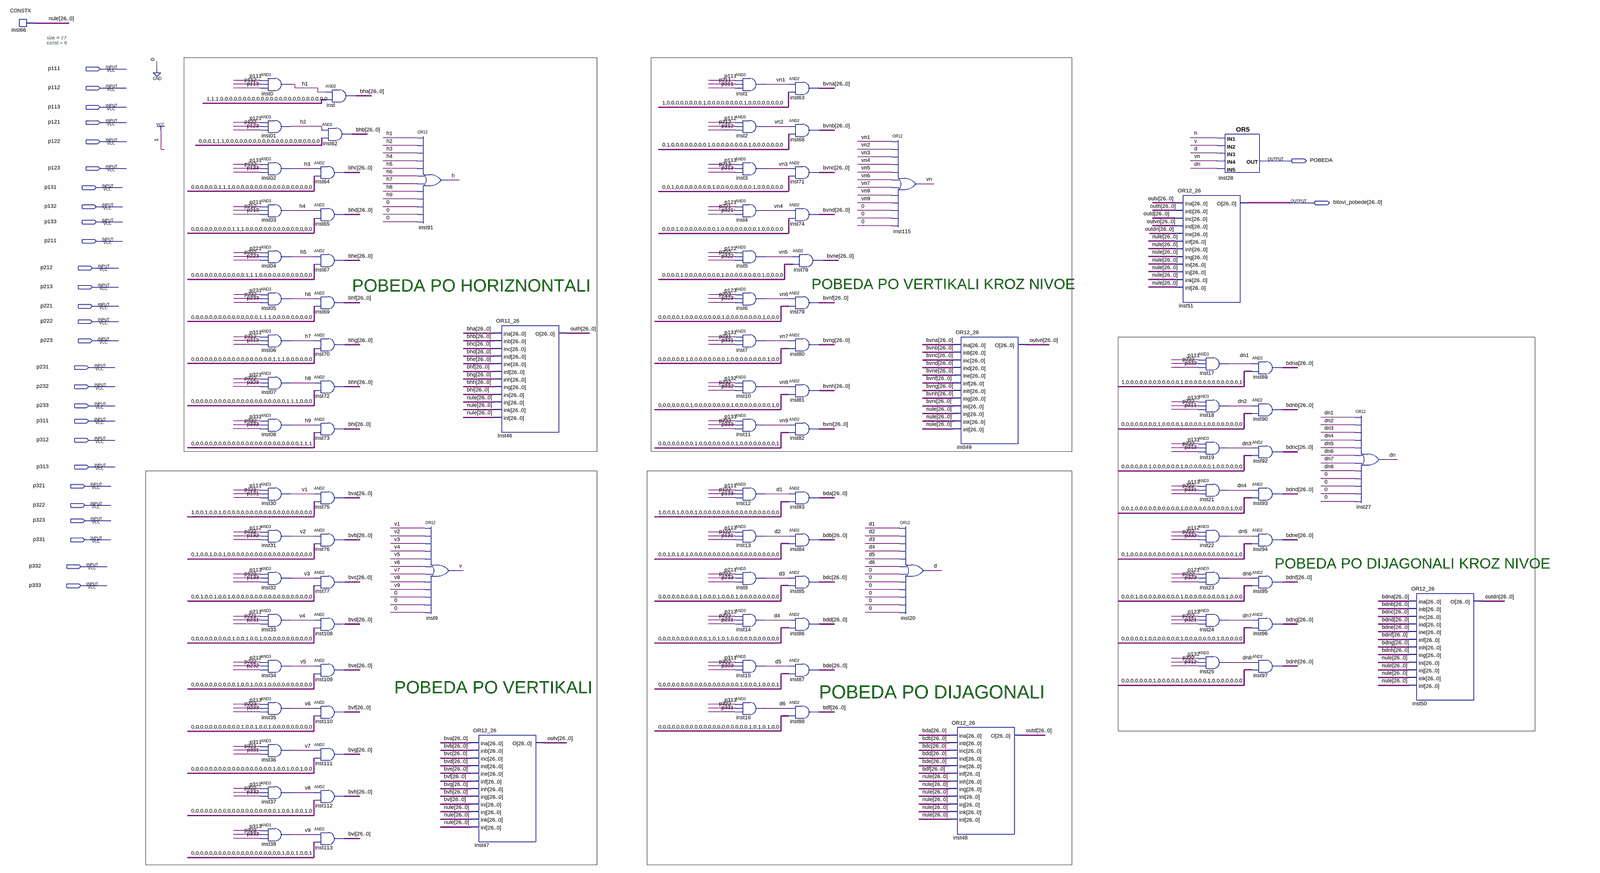
[diagram p0: schematic sheet, whole]
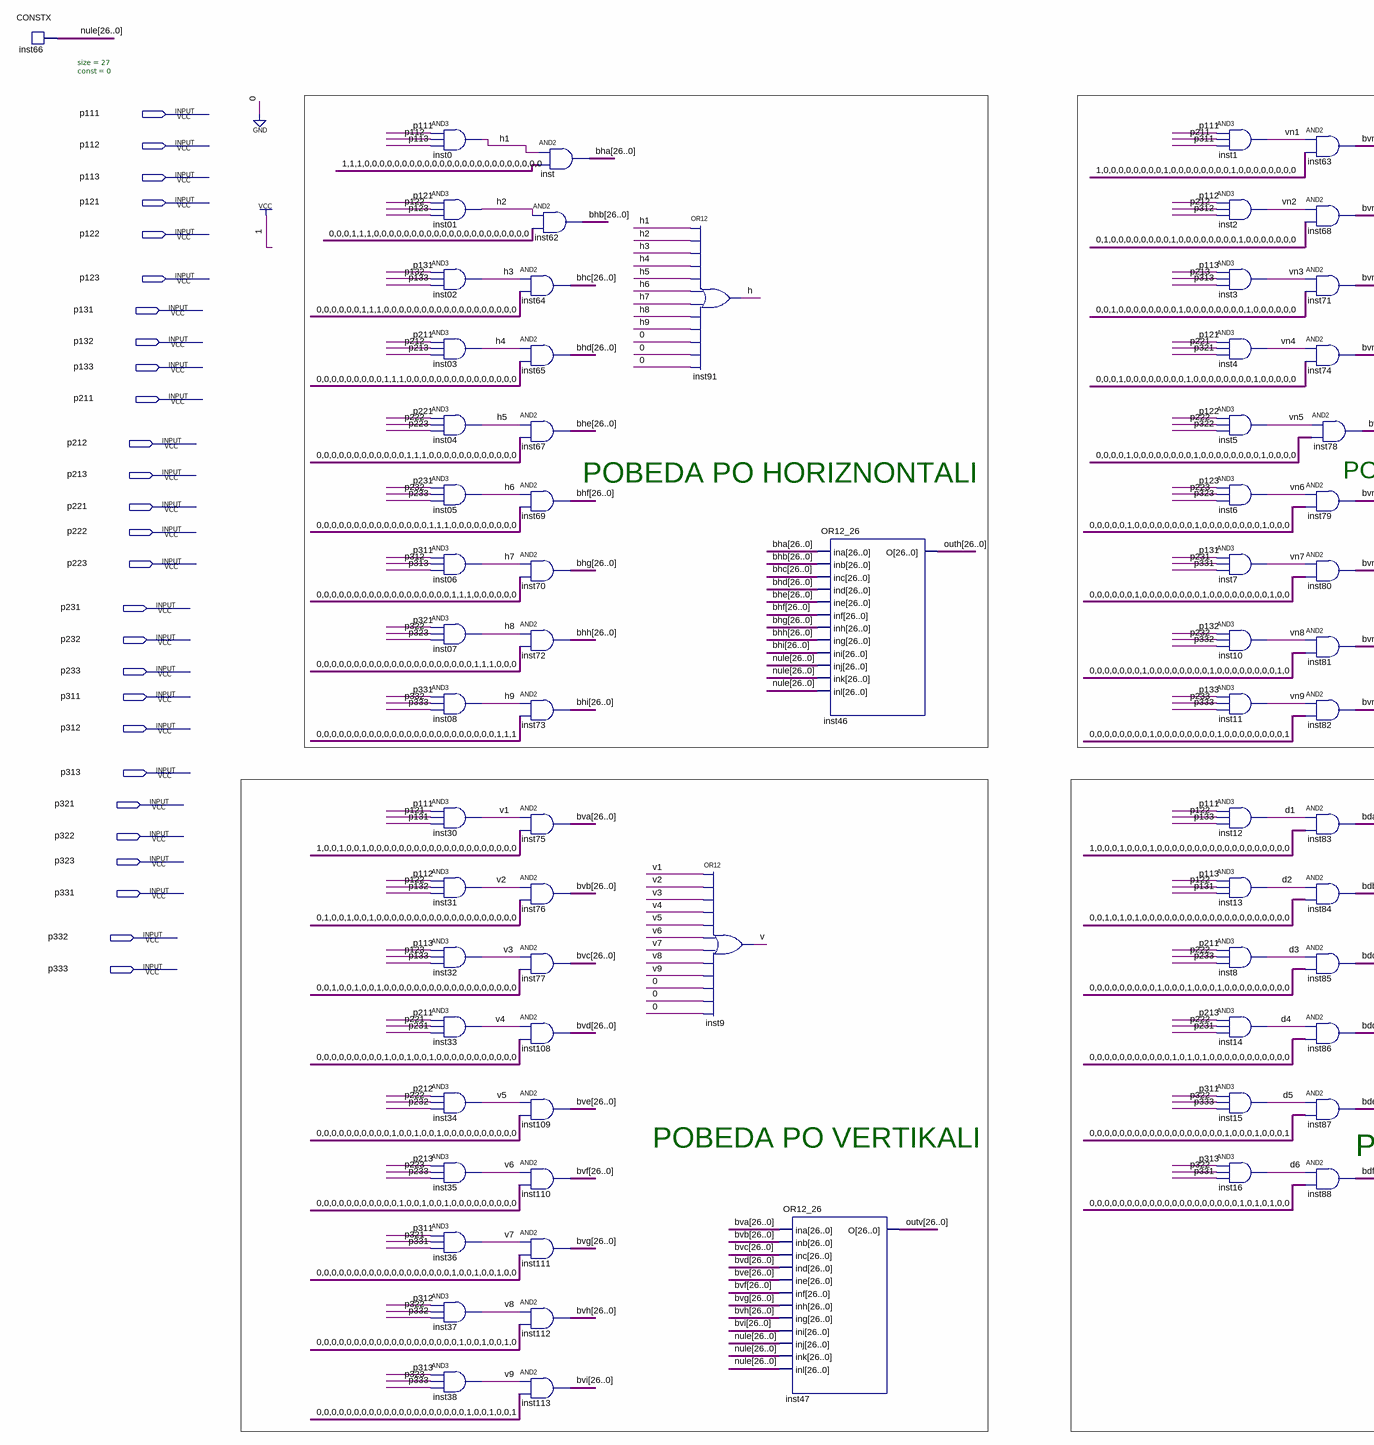
[diagram p1: schematic sheet, left part]
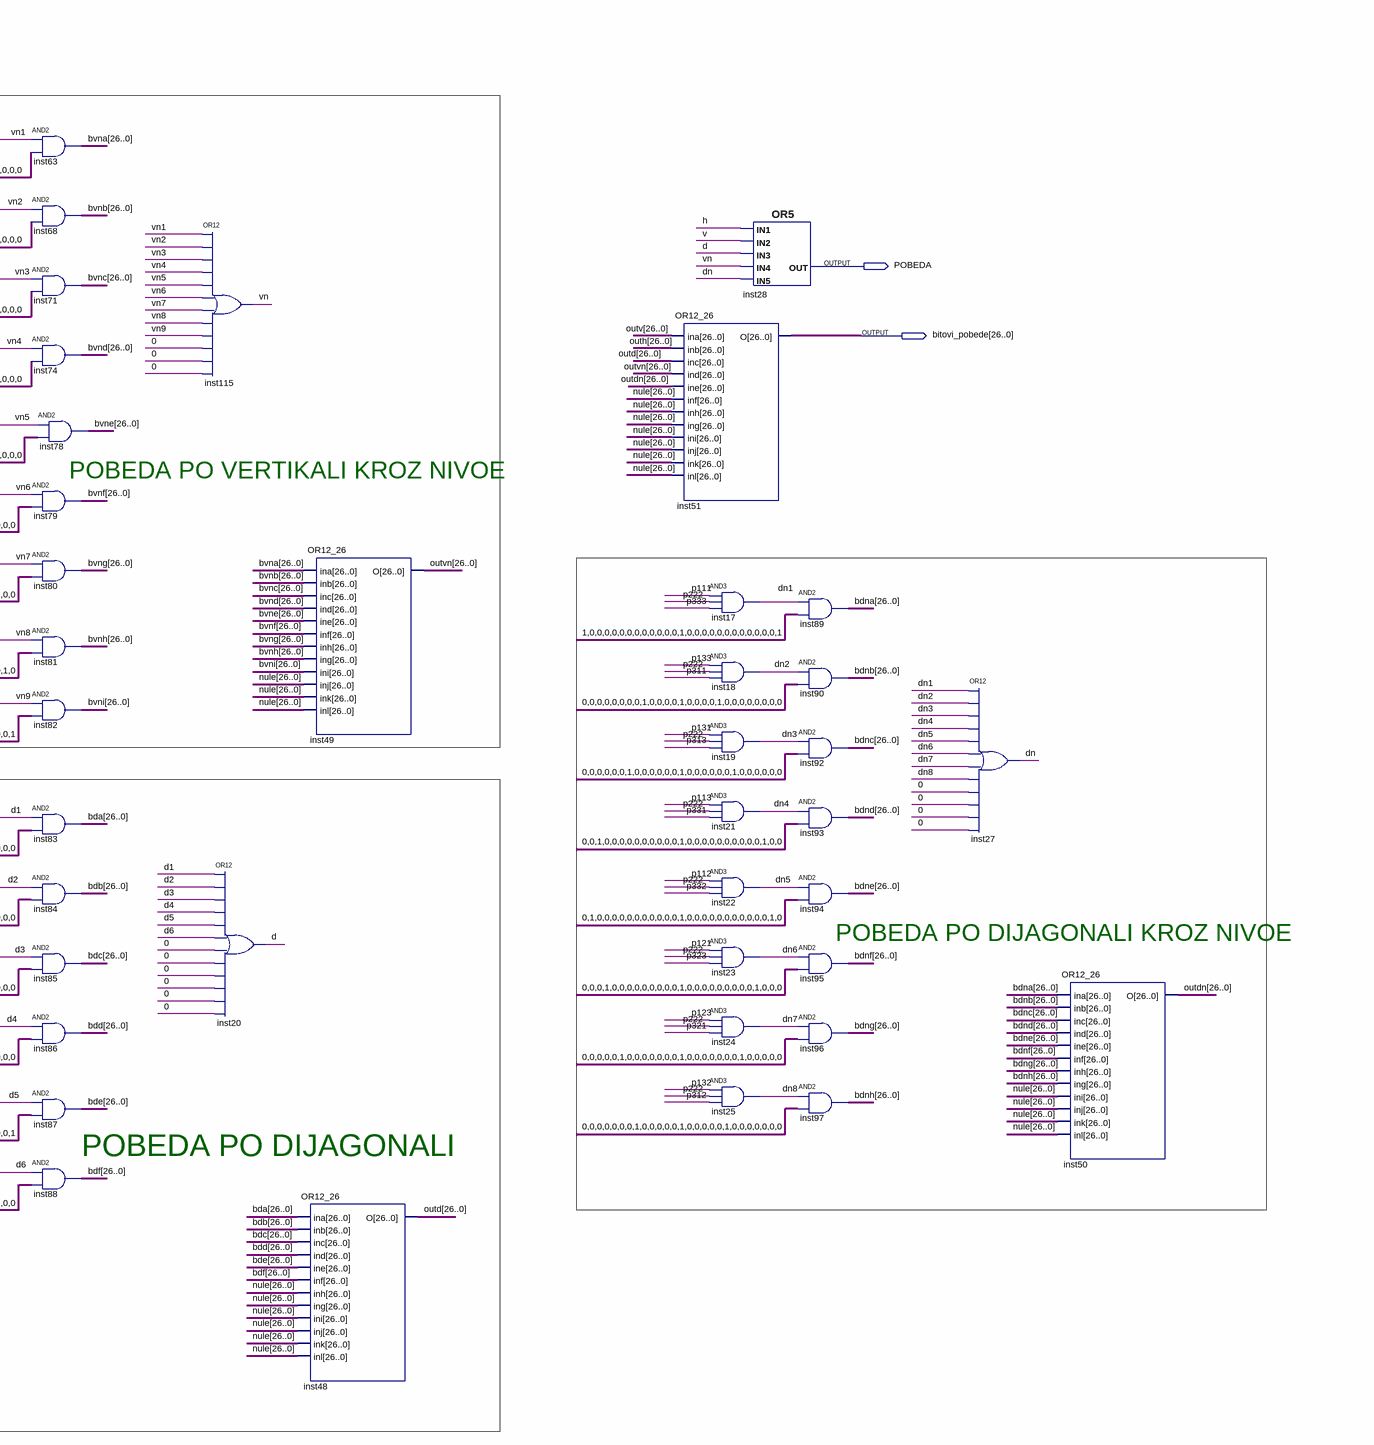
[diagram p2: schematic sheet, right part]
// Quartus schematic ProveraPobede.bdf as structural Verilog: 95 symbols, 29 pins
module ProveraPobede (
  input  p111,
  input  p112,
  input  p113,
  input  p121,
  input  p122,
  input  p123,
  input  p131,
  input  p132,
  input  p133,
  input  p211,
  input  p212,
  input  p213,
  input  p221,
  input  p222,
  input  p223,
  input  p231,
  input  p232,
  input  p233,
  input  p311,
  input  p312,
  input  p313,
  input  p321,
  input  p322,
  input  p323,
  input  p331,
  input  p332,
  input  p333,
  output POBEDA,
  output [26:0] bitovi_pobede
);

  wire d, d1, d2, d3, d4, d5, d6, dn, dn1, dn2, dn3, dn4, dn5, dn6, dn7, dn8, h, h1, h2, h3, h4, h5, h6, h7,
       h8, h9, v, v1, v2, v3, v4, v5, v6, v7, v8, v9, vn, vn1, vn2, vn3, vn4, vn5, vn6, vn7, vn8, vn9;
  wire [26:0] bda, bdb, bdc, bdd, bde, bdf, bdna, bdnb, bdnc, bdnd, bdne, bdnf, bdng, bdnh, bha, bhb, bhc,
       bhd, bhe, bhf, bhg, bhh, bhi, bva, bvb, bvc, bvd, bve, bvf, bvg, bvh, bvi, bvna, bvnb, bvnc, bvnd,
       bvne, bvnf, bvng, bvnh, bvni, nule, outd, outdn, outh, outv, outvn;

  CONSTX #(.size(27), .\const (0)) inst66 (.data(nule));
  and inst0 (h1, p111, p112, p113);
  and inst01 (h2, p121, p122, p123);
  and inst02 (h3, p131, p132, p133);
  and inst03 (h4, p211, p212, p213);
  and inst04 (h5, p221, p222, p223);
  and inst05 (h6, p231, p232, p233);
  and inst06 (h7, p311, p312, p313);
  and inst07 (h8, p321, p322, p323);
  and inst08 (h9, p331, p332, p333);
  and inst30 (v1, p111, p121, p131);
  and inst31 (v2, p112, p122, p132);
  and inst32 (v3, p113, p123, p133);
  and inst33 (v4, p211, p221, p231);
  and inst34 (v5, p212, p222, p232);
  and inst35 (v6, p213, p223, p233);
  and inst36 (v7, p311, p321, p331);
  and inst37 (v8, p312, p322, p332);
  and inst38 (v9, p313, p323, p333);
  assign bha = {27{h1}} & 27'b111000000000000000000000000;  // AND2 inst, 27 bits wide
  assign bhb = {27{h2}} & 27'b000111000000000000000000000;  // AND2 inst62, 27 bits wide
  assign bhc = {27{h3}} & 27'b000000111000000000000000000;  // AND2 inst64, 27 bits wide
  assign bhd = {27{h4}} & 27'b000000000111000000000000000;  // AND2 inst65, 27 bits wide
  assign bhe = {27{h5}} & 27'b000000000000111000000000000;  // AND2 inst67, 27 bits wide
  assign bhf = {27{h6}} & 27'b000000000000000111000000000;  // AND2 inst69, 27 bits wide
  assign bhg = {27{h7}} & 27'b000000000000000000111000000;  // AND2 inst70, 27 bits wide
  assign bhh = {27{h8}} & 27'b000000000000000000000111000;  // AND2 inst72, 27 bits wide
  assign bhi = {27{h9}} & 27'b000000000000000000000000111;  // AND2 inst73, 27 bits wide
  assign bva = {27{v1}} & 27'b100100100000000000000000000;  // AND2 inst75, 27 bits wide
  assign bvb = {27{v2}} & 27'b010010010000000000000000000;  // AND2 inst76, 27 bits wide
  assign bvc = {27{v3}} & 27'b001001001000000000000000000;  // AND2 inst77, 27 bits wide
  assign bvd = {27{v4}} & 27'b000000000100100100000000000;  // AND2 inst108, 27 bits wide
  assign bve = {27{v5}} & 27'b000000000010010010000000000;  // AND2 inst109, 27 bits wide
  assign bvf = {27{v6}} & 27'b000000000001001001000000000;  // AND2 inst110, 27 bits wide
  assign bvg = {27{v7}} & 27'b000000000000000000100100100;  // AND2 inst111, 27 bits wide
  assign bvh = {27{v8}} & 27'b000000000000000000010010010;  // AND2 inst112, 27 bits wide
  assign bvi = {27{v9}} & 27'b000000000000000000001001001;  // AND2 inst113, 27 bits wide
  or inst91 (h, h1, h2, h3, h4, h5, h6, h7, h8, h9, 1'b0, 1'b0, 1'b0);
  or inst9 (v, v1, v2, v3, v4, v5, v6, v7, v8, v9, 1'b0, 1'b0, 1'b0);
  OR12_26 inst47 (
    .ina(bva), .inb(bvb), .inc(bvc), .ind(bvd), .ine(bve), .inf(bvf), .inh(bvg), .ing(bvh), .ini(bvi),
    .inj(nule), .ink(nule), .inl(nule), .O(outv));
  OR12_26 inst46 (
    .ina(bha), .inb(bhb), .inc(bhc), .ind(bhd), .ine(bhe), .inf(bhf), .inh(bhg), .ing(bhh), .ini(bhi),
    .inj(nule), .ink(nule), .inl(nule), .O(outh));
  and inst1 (vn1, p111, p211, p311);
  and inst2 (vn2, p112, p212, p312);
  and inst3 (vn3, p113, p213, p313);
  and inst4 (vn4, p121, p221, p321);
  and inst5 (vn5, p122, p222, p322);
  and inst6 (vn6, p123, p223, p323);
  and inst7 (vn7, p131, p231, p331);
  and inst10 (vn8, p132, p232, p332);
  and inst11 (vn9, p133, p233, p333);
  and inst12 (d1, p111, p122, p133);
  and inst13 (d2, p113, p122, p131);
  and inst8 (d3, p211, p222, p233);
  and inst14 (d4, p213, p222, p231);
  and inst15 (d5, p311, p322, p333);
  and inst16 (d6, p313, p322, p331);
  assign bvna = {27{vn1}} & 27'b100000000100000000100000000;  // AND2 inst63, 27 bits wide
  assign bvnb = {27{vn2}} & 27'b010000000010000000010000000;  // AND2 inst68, 27 bits wide
  assign bvnc = {27{vn3}} & 27'b001000000001000000001000000;  // AND2 inst71, 27 bits wide
  assign bvnd = {27{vn4}} & 27'b000100000000100000000100000;  // AND2 inst74, 27 bits wide
  assign bvne = {27{vn5}} & 27'b000010000000010000000010000;  // AND2 inst78, 27 bits wide
  assign bvnf = {27{vn6}} & 27'b000001000000001000000001000;  // AND2 inst79, 27 bits wide
  assign bvng = {27{vn7}} & 27'b000000100000000100000000100;  // AND2 inst80, 27 bits wide
  assign bvnh = {27{vn8}} & 27'b000000010000000010000000010;  // AND2 inst81, 27 bits wide
  assign bvni = {27{vn9}} & 27'b000000001000000001000000001;  // AND2 inst82, 27 bits wide
  assign bda = {27{d1}} & 27'b100010001000000000000000000;  // AND2 inst83, 27 bits wide
  assign bdb = {27{d2}} & 27'b001010100000000000000000000;  // AND2 inst84, 27 bits wide
  assign bdc = {27{d3}} & 27'b000000000100010001000000000;  // AND2 inst85, 27 bits wide
  assign bdd = {27{d4}} & 27'b000000000001010100000000000;  // AND2 inst86, 27 bits wide
  assign bde = {27{d5}} & 27'b000000000000000000100010001;  // AND2 inst87, 27 bits wide
  assign bdf = {27{d6}} & 27'b000000000000000000001010100;  // AND2 inst88, 27 bits wide
  or inst115 (vn, vn1, vn2, vn3, vn4, vn5, vn6, vn7, vn8, vn9, 1'b0, 1'b0, 1'b0);
  or inst20 (d, d1, d2, d3, d4, d5, d6, 1'b0, 1'b0, 1'b0, 1'b0, 1'b0, 1'b0);
  OR12_26 inst48 (
    .ina(bda), .inb(bdb), .inc(bdc), .ind(bdd), .ine(bde), .inf(bdf), .inh(nule), .ing(nule), .ini(nule),
    .inj(nule), .ink(nule), .inl(nule), .O(outd));
  OR12_26 inst49 (
    .ina(bvna), .inb(bvnb), .inc(bvnc), .ind(bvnd), .ine(bvne), .inf(bvnf), .inh(bvng), .ing(bvnh),
    .ini(bvni), .inj(nule), .ink(nule), .inl(nule), .O(outvn));
  OR12_26 inst51 (
    .ina(outv), .inb(outh), .inc(outd), .ind(outvn), .ine(outdn), .inf(nule), .inh(nule), .ing(nule),
    .ini(nule), .inj(nule), .ink(nule), .inl(nule), .O(bitovi_pobede));
  or inst28 (POBEDA, h, v, d, vn, dn);
  and inst17 (dn1, p111, p222, p333);
  and inst18 (dn2, p133, p222, p311);
  and inst19 (dn3, p131, p222, p313);
  and inst21 (dn4, p113, p222, p331);
  and inst22 (dn5, p112, p222, p332);
  and inst23 (dn6, p121, p222, p323);
  and inst24 (dn7, p123, p222, p321);
  and inst25 (dn8, p132, p222, p312);
  assign bdna = {27{dn1}} & 27'b100000000000010000000000001;  // AND2 inst89, 27 bits wide
  assign bdnb = {27{dn2}} & 27'b000000001000010000100000000;  // AND2 inst90, 27 bits wide
  assign bdnc = {27{dn3}} & 27'b000000100000010000001000000;  // AND2 inst92, 27 bits wide
  assign bdnd = {27{dn4}} & 27'b001000000000010000000000100;  // AND2 inst93, 27 bits wide
  assign bdne = {27{dn5}} & 27'b010000000000010000000000010;  // AND2 inst94, 27 bits wide
  assign bdnf = {27{dn6}} & 27'b000100000000010000000001000;  // AND2 inst95, 27 bits wide
  assign bdng = {27{dn7}} & 27'b000001000000010000000100000;  // AND2 inst96, 27 bits wide
  assign bdnh = {27{dn8}} & 27'b000000010000010000010000000;  // AND2 inst97, 27 bits wide
  or inst27 (dn, dn1, dn2, dn3, dn4, dn5, dn6, dn7, dn8, 1'b0, 1'b0, 1'b0, 1'b0);
  OR12_26 inst50 (
    .ina(bdna), .inb(bdnb), .inc(bdnc), .ind(bdnd), .ine(bdne), .inf(bdnf), .inh(bdng), .ing(bdnh),
    .ini(nule), .inj(nule), .ink(nule), .inl(nule), .O(outdn));

  // Notes on the sheet:
  //   POBEDA PO HORIZNONTALI
  //   POBEDA PO VERTIKALI KROZ NIVOE
  //   POBEDA PO DIJAGONALI KROZ NIVOE
  //   POBEDA PO VERTIKALI
  //   POBEDA PO DIJAGONALI
endmodule
